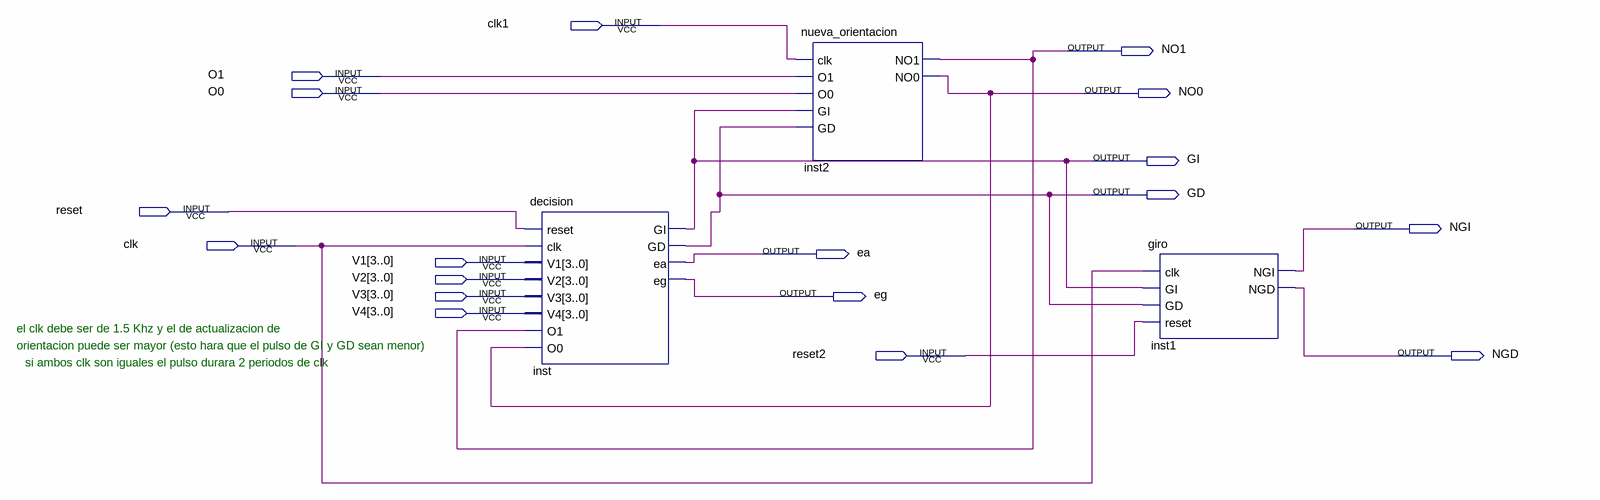
[diagram p0: schematic sheet]
// Quartus schematic decisionfinal.bdf as structural Verilog: 3 symbols, 18 pins
module decisionfinal (
  input  clk1,
  input  O1,
  input  O0,
  input  reset,
  input  clk,
  input  [3:0] V1,
  input  [3:0] V2,
  input  [3:0] V3,
  input  [3:0] V4,
  input  reset2,
  output NO1,
  output NO0,
  output GI,
  output GD,
  output NGI,
  output ea,
  output eg,
  output NGD
);

  decision inst (
    .reset(reset), .clk(clk), .V1(V1), .V2(V2), .V3(V3), .V4(V4), .O1(NO1), .O0(NO0), .GI(GI), .GD(GD),
    .ea(ea), .eg(eg));
  nueva_orientacion inst2 (.clk(clk1), .O1(O1), .O0(O0), .GI(GI), .GD(GD), .NO1(NO1), .NO0(NO0));
  giro inst1 (.clk(clk), .GI(GI), .GD(GD), .reset(reset2), .NGI(NGI), .NGD(NGD));

  // Notes on the sheet:
  //   el clk debe ser de 1.5 Khz y el de actualizacion de  
  //   orientacion puede ser mayor (esto hara que el pulso de GI y GD sean menor)
  //   si ambos clk son iguales el pulso durara 2 periodos de clk
endmodule
